# Altium schematic sheet AHD Master Schematic.SchDoc: Abstract Hardware Device Master Sheet
size A; DrawnBy: Adam Vadala-Roth; DocumentNumber: 1; Revision: 2.3b; SheetNumber: 1; SheetTotal: 9
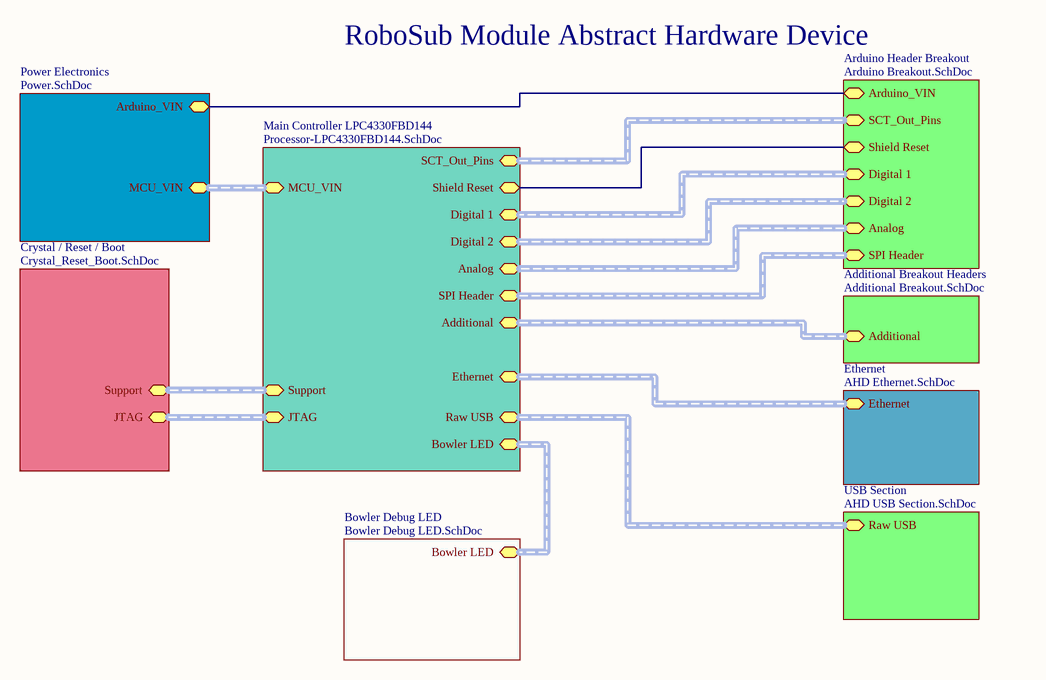
[diagram p0: AHD Master Schematic.SchDoc]

## Sub-sheets
Additional Breakout Headers = Additional Breakout.SchDoc: Additional (harness Additional)
Arduino Header Breakout = Arduino Breakout.SchDoc: Analog (harness Analog), Digital 1 (harness Digital 1), Digital 2 (harness Digital 2), Arduino_VIN, SCT_Out_Pins (harness SCT_Out_Pins), SPI Header (harness SPI_Header), Shield Reset
Bowler Debug LED = Bowler Debug LED.SchDoc: Bowler LED (harness Bowler LED)
Crystal / Reset / Boot = Crystal_Reset_Boot.SchDoc: JTAG (harness JTAG), Support (harness Support)
Ethernet = AHD Ethernet.SchDoc: Ethernet (harness Ethernet)
Main Controller LPC4330FBD144 = Processor-LPC4330FBD144.SchDoc: Digital 2 (harness Digital 2), Digital 1 (harness Digital 1), Analog (harness Analog), Ethernet, JTAG (harness JTAG), MCU_VIN (harness MCU_VIN), Bowler LED (harness Bowler LED), Additional (harness Additional), SCT_Out_Pins (harness SCT_Out_Pins), SPI Header (harness SPI_Header), Support (harness Support), Raw USB (harness Raw USB), Shield Reset
Power Electronics = Power.SchDoc: MCU_VIN (harness MCU_VIN), Arduino_VIN
USB Section = AHD USB Section.SchDoc: Raw USB (harness Raw USB)

## Nets
(unnamed): sheet Power Electronics/Arduino_VIN, sheet Arduino Header Breakout/Arduino_VIN
(unnamed): sheet Main Controller LPC4330FBD144/Shield Reset, sheet Arduino Header Breakout/Shield Reset

## Buses and harness runs
harness sheet Additional Breakout Headers/Additional = sheet Main Controller LPC4330FBD144/Additional
harness sheet Arduino Header Breakout/Analog = sheet Main Controller LPC4330FBD144/Analog
harness sheet Arduino Header Breakout/Digital 1 = sheet Main Controller LPC4330FBD144/Digital 1
harness sheet Arduino Header Breakout/Digital 2 = sheet Main Controller LPC4330FBD144/Digital 2
harness sheet Arduino Header Breakout/SCT_Out_Pins = sheet Main Controller LPC4330FBD144/SCT_Out_Pins
harness sheet Arduino Header Breakout/SPI Header = sheet Main Controller LPC4330FBD144/SPI Header
harness sheet Bowler Debug LED/Bowler LED = sheet Main Controller LPC4330FBD144/Bowler LED
harness sheet Crystal / Reset / Boot/JTAG = sheet Main Controller LPC4330FBD144/JTAG
harness sheet Crystal / Reset / Boot/Support = sheet Main Controller LPC4330FBD144/Support
harness sheet Ethernet/Ethernet = sheet Main Controller LPC4330FBD144/Ethernet
harness sheet Main Controller LPC4330FBD144/MCU_VIN = sheet Power Electronics/MCU_VIN
harness sheet Main Controller LPC4330FBD144/Raw USB = sheet USB Section/Raw USB

## Notes on the sheet
- RoboSub Module Abstract Hardware Device